# EAGLE board untitled (EAGLE 9.6.2)
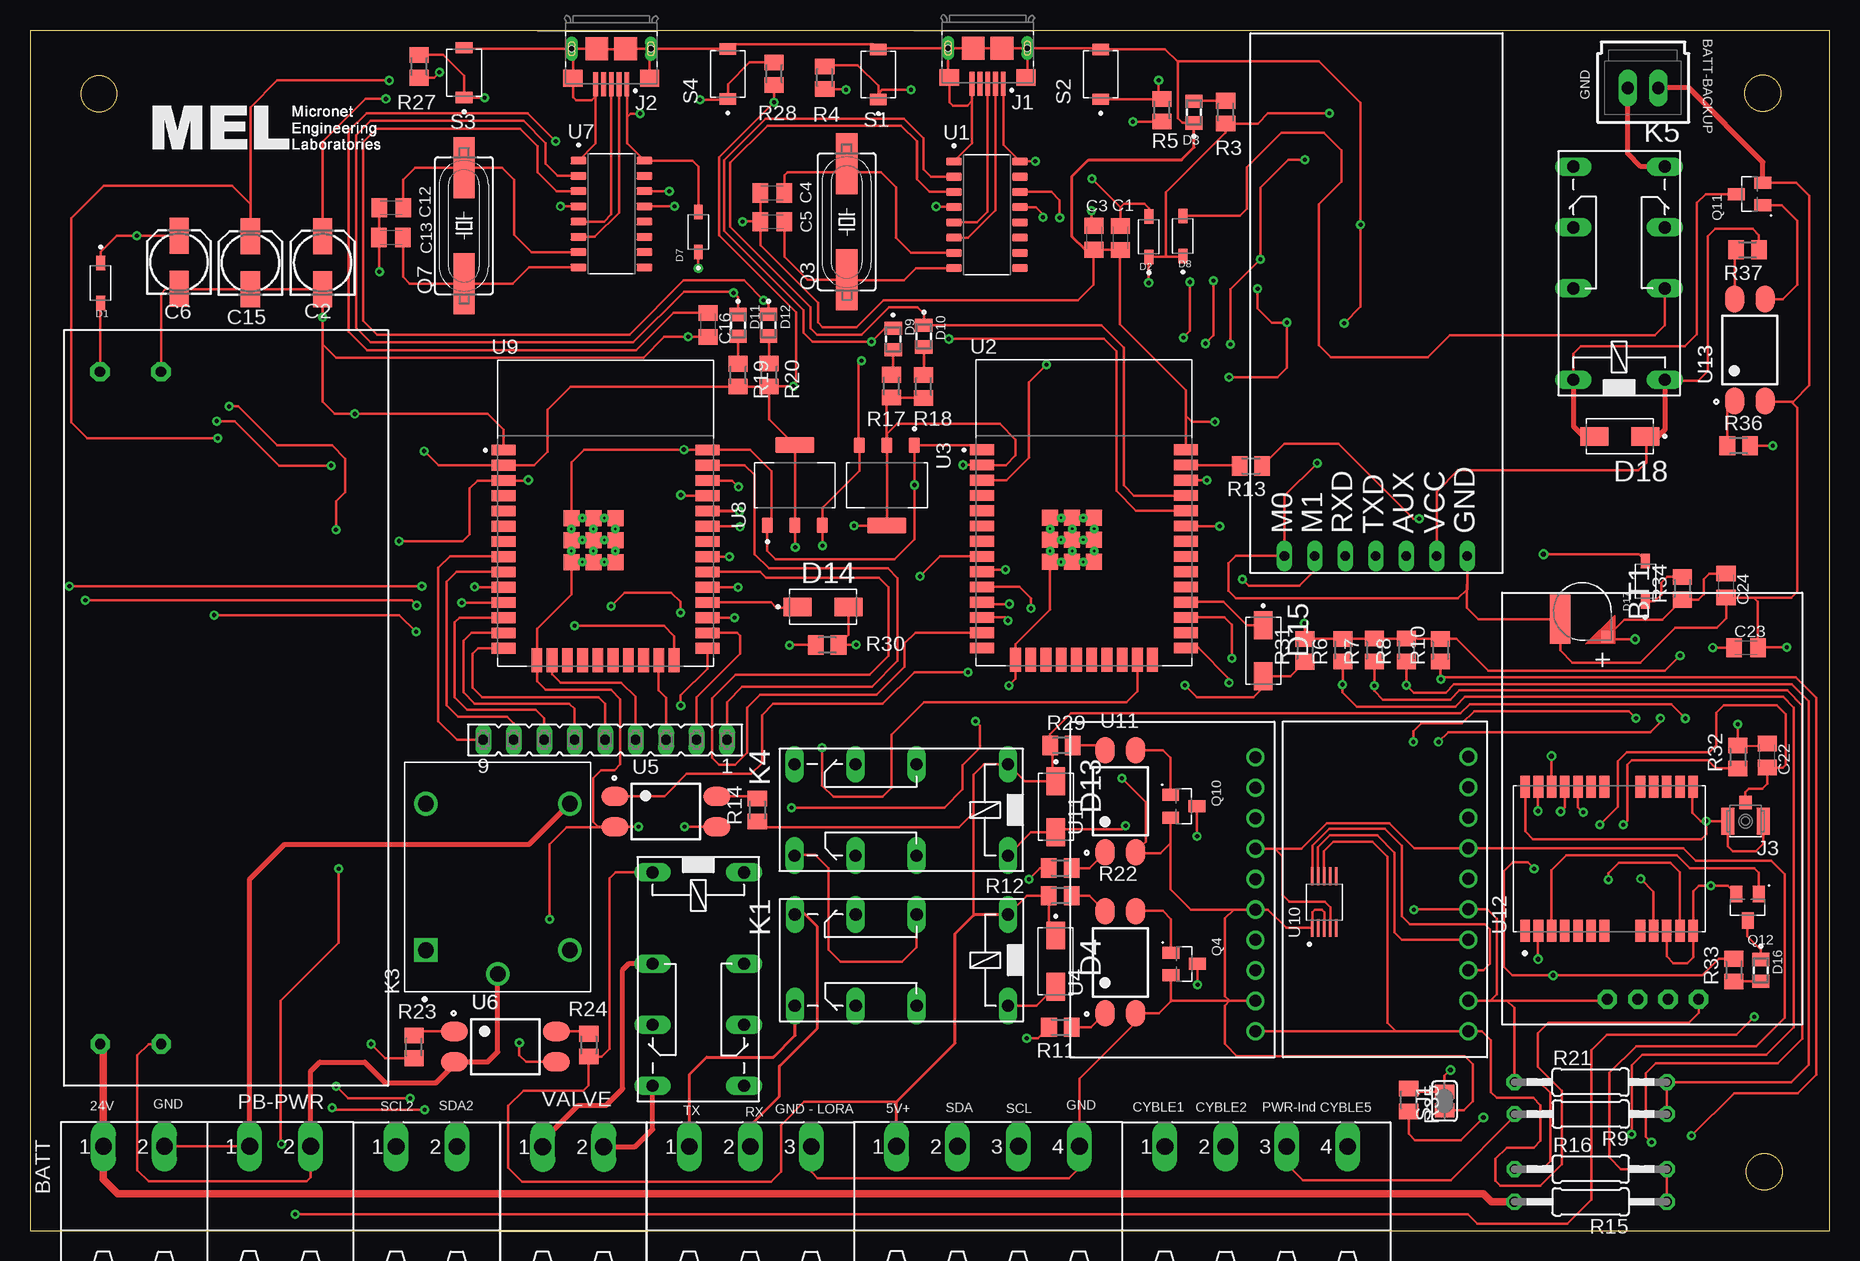
[diagram p1: board, top side]
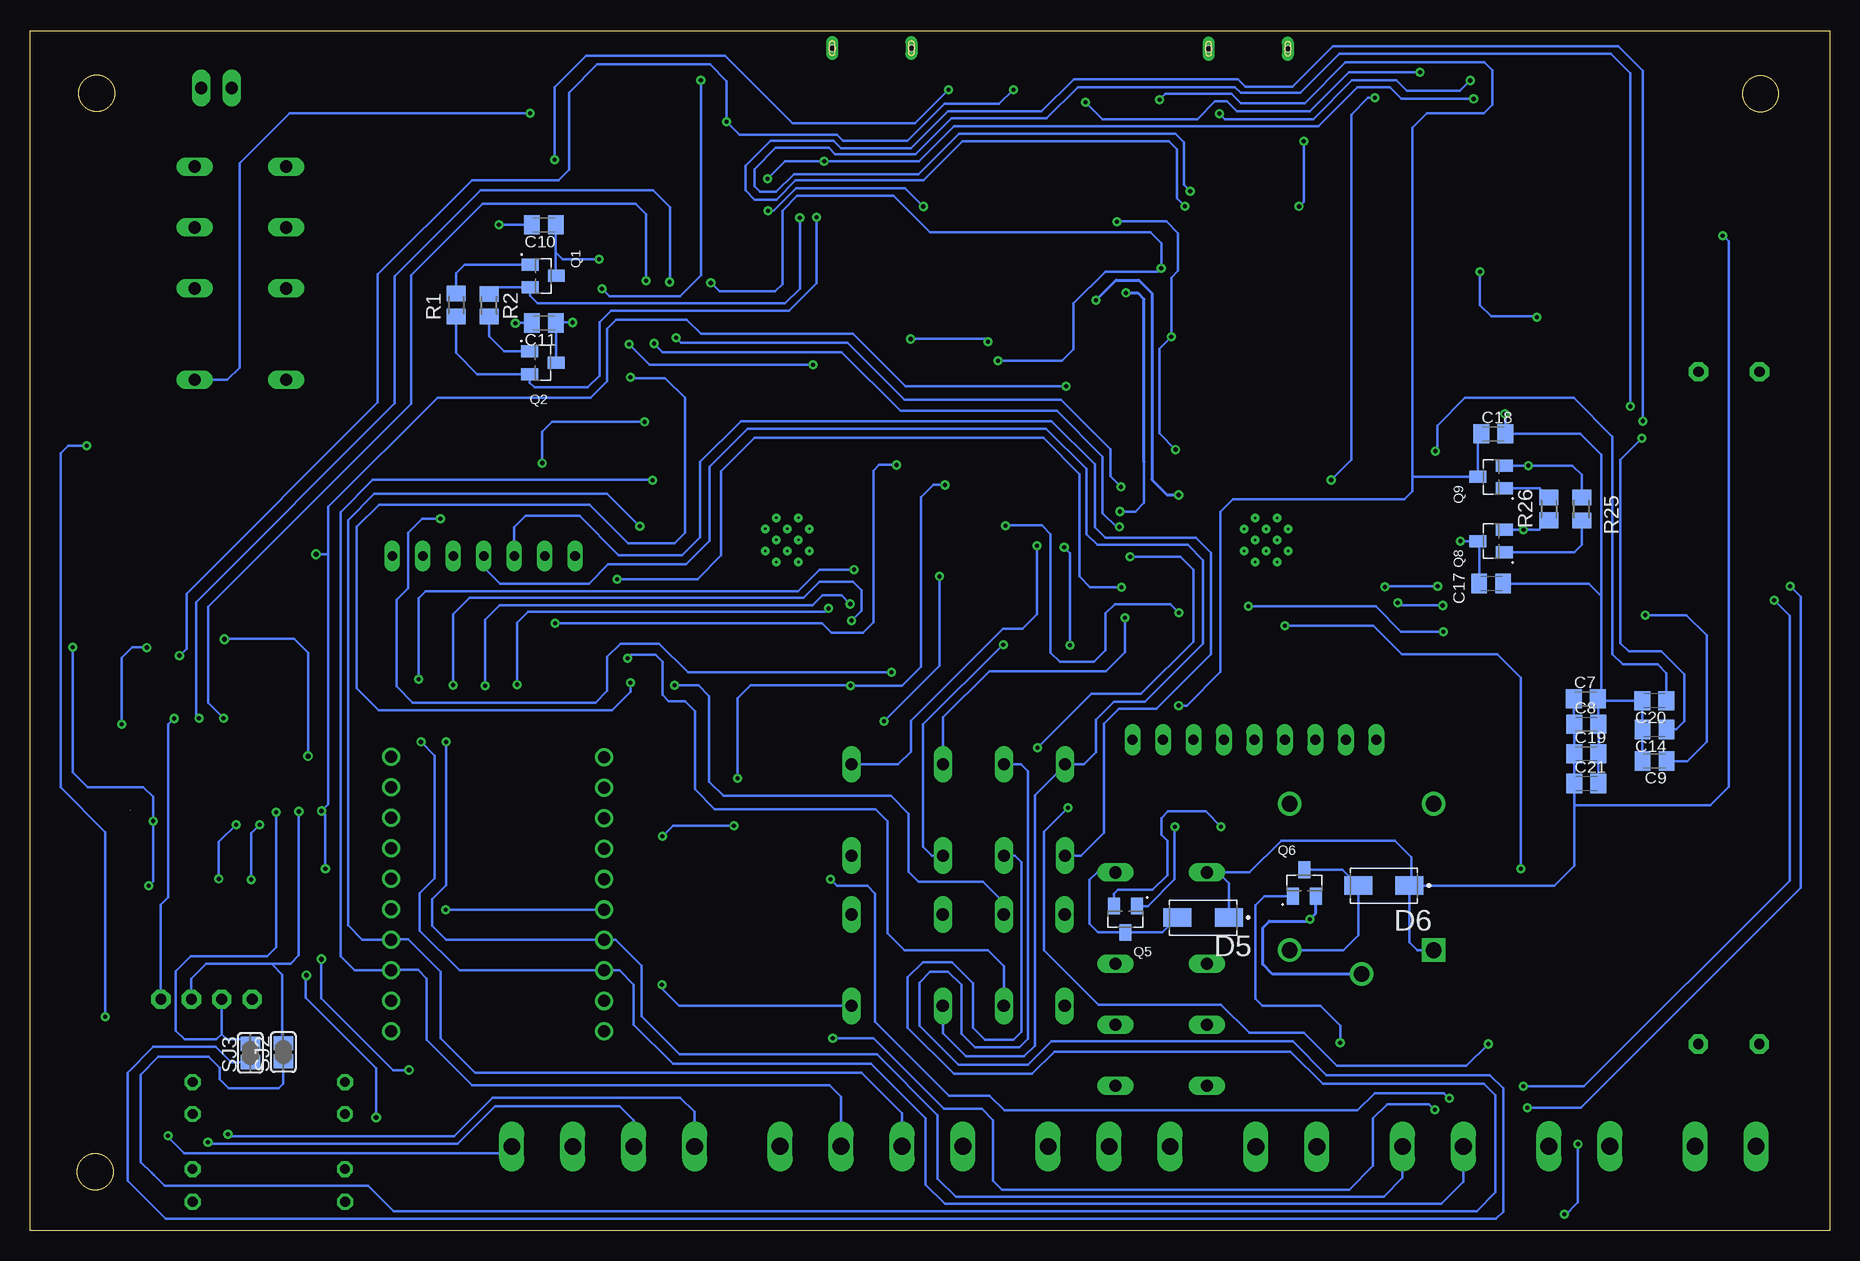
[diagram p2: board, bottom side, seen from below]

Size 150 x 100 mm. Coordinates in mm from the lower left corner, seen from the top.
Outline: 0,0 150,0 150,100 0,100 0,0
Outline: circle at 5.75,94.74 radius 1.5
Outline: circle at 144.45,94.82 radius 1.5
Outline: circle at 144.58,4.94 radius 1.5
Copper layers (1*16): Top 0.035mm / dielectric 1.5mm / Bottom 0.035mm
Design rules "default *": minimum track width 6mil, minimum drill 0.3mm, track to track 6mil, track to pad 6mil, pad to pad 6mil, via to via 6mil, smd to smd 6mil, copper to edge 40mil, drill to drill 6mil, minimum pad ring 10mil, minimum via ring 8mil, stop-mask expansion 4mil, vias tented up to drill 0mil, thermal gap 10mil

## Footprints (pad centres in the part's own frame; a part is rotated, then mirrored left to right if it is on the bottom)
ADS1115 = drill 1: A0 -6.35,-1.27; A1 -6.35,-3.81; A2 -6.35,-6.35; A3 -6.35,-8.89; ADDR -6.35,3.81; ALRT -6.35,1.27; GND -6.35,11.43; SCL -6.35,8.89; SDA -6.35,6.35; VDD -6.35,13.97
SEIKO_ML414H_IV01E = smd 1 x 1: 1 2.1,2.1 | smd 4.1 x 1.7: 2 0.65,-1.85
C0805K = smd 1.3 x 1.6: 1 -1,0; 2 1,0
153CLV-0505 = smd 3 x 1.6: + 2.2,0; - -2.2,0
SOD3715X145N = smd 1.21 x 0.73: A 1.68,0; C -1.68,0
LEDC2012X120N = smd 1.1 x 1.45: A 0.9,0; C -0.9,0
DIOM5226X240N = smd 2.33 x 1.55: A 2.135,0; C -2.135,0
EBYTEE220-900T22D = drill 0.8 pad 1.27 long: AUX -4.56,-10.98; GND -4.56,-16.06; M0 -4.56,-0.82; M1 -4.56,-3.36; RXD -4.56,-5.9; TXD -4.56,-8.44; VCC -4.56,-13.52
FCI_10118193-0001LF = smd 0.4 x 2: 1 -1.3,2.975; 2 -0.65,2.975; 3 0,2.975; 4 0.65,2.975; 5 1.3,2.975 | smd 1.6 x 1.4: S1 -3.2,2.45; S2 3.2,2.45 | smd 1.9 x 1.9: S3 1.2,0; S4 -1.2,0 | drill 0.5 pad 0.9 long: S5 -3.3,0; S6 3.3,0 | hole 0.5: -3.3,0; 3.3,0
HRS_U.FL-R-SMT(01) = smd 1.1 x 2.25: 1 -1.475,0; 2 1.475,0 | smd 1.05 x 1.1: 3 0,-1.55
351 = drill 1.016 long: 1 -3.81,-3.81; 16 -3.81,3.81; O1 8.89,-3.81; O2 8.89,3.81; P1 3.81,-3.81; P2 3.81,3.81; S1 13.97,-3.81; S2 13.97,3.81
RELAY_SRD-05VDC-SL-C = drill 1.32 square: A1 -6.1,6 | drill 1.32: A2 -6.1,-6; NC 6.1,6; NO 6.1,-6 | drill 1.29: COM -8.1,0
NEO-6MGPS = drill 0.9 pad 1.6 octagon: 5V -8.89,7.62; GND -8.89,15.24; RX -8.89,10.16; TX -8.89,12.7
SOT95P240X120-3N = smd 1 x 1.4: 1 -0.95,-1.1; 2 0.95,-1.1; 3 0,1.1
SM49 = smd 5.08 x 1.778: 1 -4.826,0; 2 4.826,0
M0805 = smd 1.3 x 1.6: 1 -0.95,0; 2 0.95,0
0207/12 = drill 0.813 octagon: 1 -6.35,0; 2 6.35,0
SW_TL1015AF160QG = smd 0.95 x 1.4: 1 -2.075,0; 2 2.075,0
SJ = smd 1.168 x 1.6: 1 -0.762,0; 2 0.762,0
SUPER-STEPDOWN = drill 0.85 pad 1.6 octagon: +5V 59.509,24.006; GND 59.509,18.926; IN+ 3.478,23.979; IN- 3.478,18.899
FE09 = drill 0.813 long: 1 -10.16,0; 2 -7.62,0; 3 -5.08,0; 4 -2.54,0; 5 0,0; 6 2.54,0; 7 5.08,0; 8 7.62,0; 9 10.16,0
SOIC127P600X180-16N = smd 1.31 x 0.62: 1 -2.75,4.445; 2 -2.75,3.175; 3 -2.75,1.905; 4 -2.75,0.635; 5 -2.75,-0.635; 6 -2.75,-1.905; 7 -2.75,-3.175; 8 -2.75,-4.445; 9 2.75,-4.445; 10 2.75,-3.175; 11 2.75,-1.905; 12 2.75,-0.635; 13 2.75,0.635; 14 2.75,1.905; 15 2.75,3.175; 16 2.75,4.445
MODULE_ESP32-WROOM-32D = smd 2 x 0.9: 1 -8.5,5.26; 2 -8.5,3.99; 3 -8.5,2.72; 4 -8.5,1.45; 5 -8.5,0.18; 6 -8.5,-1.09; 7 -8.5,-2.36; 8 -8.5,-3.63; 9 -8.5,-4.9; 10 -8.5,-6.17; 11 -8.5,-7.44; 12 -8.5,-8.71; 13 -8.5,-9.98; 14 -8.5,-11.25; 25 8.5,-11.25; 26 8.5,-9.98; 27 8.5,-8.71; 28 8.5,-7.44; 29 8.5,-6.17; 30 8.5,-4.9; 31 8.5,-3.63; 32 8.5,-2.36; 33 8.5,-1.09; 34 8.5,0.18; 35 8.5,1.45; 36 8.5,2.72; 37 8.5,3.99; 38 8.5,5.26 | smd 0.9 x 2: 15 -5.715,-12.25; 16 -4.445,-12.25; 17 -3.175,-12.25; 18 -1.905,-12.25; 19 -0.635,-12.25; 20 0.635,-12.25; 21 1.905,-12.25; 22 3.175,-12.25; 23 4.445,-12.25; 24 5.715,-12.25 | smd 1.33 x 1.33: 39_1 -2.835,-0.405; 39_2 -1,-0.405; 39_3 0.835,-0.405; 39_4 -2.835,-2.24; 39_5 -1,-2.24; 39_6 0.835,-2.24; 39_7 -2.835,-4.075; 39_8 -1,-4.075; 39_9 0.835,-4.075 | drill 0.2 pad 0.3: 39_10 -1.917,-0.405; 39_11 -0.083,-0.405; 39_12 -2.835,-1.323; 39_13 -1,-1.323; 39_14 0.835,-1.323; 39_15 -1.917,-2.24; 39_16 -0.083,-2.24; 39_17 -2.835,-3.158; 39_18 -1,-3.158; 39_19 0.835,-3.158; 39_20 -1.917,-4.075; 39_21 -0.083,-4.075
SOT229P700X180-4N = smd 1.31 x 0.93: 1 -3.345,2.29; 2 -3.345,0; 3 -3.345,-2.29 | smd 1.31 x 3.24: 4 3.345,0
SOT254P975X400-4N = smd 2.25 x 1.6: 1 -4.25,1.27; 2 -4.25,-1.27; 3 4.25,-1.27; 4 4.25,1.27
SOP50P490X110-10N = smd 1.47 x 0.28: 1 -2.15,1; 2 -2.15,0.5; 3 -2.15,0; 4 -2.15,-0.5; 5 -2.15,-1; 6 2.15,-1; 7 2.15,-0.5; 8 2.15,0; 9 2.15,0.5; 10 2.15,1
XCVR_NEO-M8N-0 = smd 1.8 x 0.8: 1 -6,7; 2 -6,5.9; 3 -6,4.8; 4 -6,3.7; 5 -6,2.6; 6 -6,1.5; 7 -6,0.4; 8 -6,-2.6; 9 -6,-3.7; 10 -6,-4.8; 11 -6,-5.9; 12 -6,-7; 13 6,-7; 14 6,-5.9; 15 6,-4.8; 16 6,-3.7; 17 6,-2.6; 18 6,0.4; 19 6,1.5; 20 6,2.6; 21 6,3.7; 22 6,4.8; 23 6,5.9; 24 6,7
MSTBA2 = drill 1.397 long: 1 -2.54,5.08; 2 2.54,5.08
MSTBA4 = drill 1.397 long: 1 -7.62,5.08; 2 -2.54,5.08; 3 2.54,5.08; 4 7.62,5.08
MSTBA3 = drill 1.397 long: 1 -5.08,5.08; 2 0,5.08; 3 5.08,5.08
70543-02 = drill 1.016 long: 1 -1.27,0; 2 1.27,0

## Placement (x,y rotation side)
ADS1  [ADS1115]  113.53,30.61 180 top
ADS2  [ADS1115]  95.8,30.59 180 top
BT1  ML414H_IV01E  [SEIKO_ML414H_IV01E]  129.4,51.62 270 top
C1  1uF  [C0805K]  90.89,82.75 270 top
C2  10uF/16V  [153CLV-0505]  24.39,80.68 90 top
C3  100nF  [C0805K]  88.7,82.76 270 top
C4  22pF  [C0805K]  61.88,86.48 0 top
C5  22pF  [C0805K]  61.89,84.09 0 top
C6  10uF/16V  [153CLV-0505]  12.43,80.73 90 top
C7  1uF  [C0805K]  20.31,44.33 0 bottom
C8  1uF  [C0805K]  20.27,42.21 0 bottom
C9  1uF  [C0805K]  14.59,39.15 180 bottom
C10  100nF  [C0805K]  107.17,83.84 180 bottom
C11  100nF  [C0805K]  107.16,75.66 180 bottom
C12  22pF  [C0805K]  30.12,85.26 0 top
C13  22pF  [C0805K]  30.1,82.78 0 top
C14  1uF  [C0805K]  14.6,41.79 180 bottom
C15  10uF/16V  [153CLV-0505]  18.38,80.67 90 top
C16  100nF  [C0805K]  56.52,75.5 270 top
C17  100nF  [C0805K]  28.19,53.95 0 bottom
C18  100nF  [C0805K]  28.02,66.42 0 bottom
C19  1uF  [C0805K]  20.27,39.76 0 bottom
C20  1uF  [C0805K]  14.6,44.19 180 bottom
C21  100nF  [C0805K]  20.27,37.28 0 bottom
C22  27nH  [C0805K]  144.81,39.6 270 top
C23  10nF  [C0805K]  143.04,48.59 0 top
C24  1uF  [C0805K]  141.38,53.77 270 top
D1  1N5819HW-7  [SOD3715X145N]  5.89,78.98 270 top
D2  1N5819HW-7  [SOD3715X145N]  93.26,82.85 90 top
D3  SML-LXT0805IW-TR  [LEDC2012X120N]  97.02,93.23 90 top
D4  US1M-13  [DIOM5226X240N]  85.5,22.48 270 top
D5  US1M-13  [DIOM5226X240N]  52.21,26.11 180 bottom
D6  US1M-13  [DIOM5226X240N]  37.15,28.78 180 bottom
D7  1N5819HW-7  [SOD3715X145N]  55.71,83.24 90 top
D8  1N5819HW-7  [SOD3715X145N]  96.1,82.9 90 top
D9  SML-LXT0805IW-TR  [LEDC2012X120N]  71.94,74.32 270 top
D10  SML-LXT0805IW-TR  [LEDC2012X120N]  74.51,74.56 270 top
D11  SML-LXT0805IW-TR  [LEDC2012X120N]  59.02,75.46 270 top
D12  SML-LXT0805IW-TR  [LEDC2012X120N]  61.57,75.48 270 top
D13  US1M-13  [DIOM5226X240N]  85.51,35.33 270 top
D14  US1M-13  [DIOM5226X240N]  66.1,52 0 top
D15  US1M-13  [DIOM5226X240N]  102.79,48.34 270 top
D16  SML-LXT0805IW-TR  [LEDC2012X120N]  144.27,21.71 270 top
D17  1N5819HW-7  [SOD3715X145N]  134.65,54.13 90 top
D18  US1M-13  [DIOM5226X240N]  132.52,66.21 180 top
EBYTEE220-900T22D1  [EBYTEE220-900T22D]  103.74,60.81 90 top
J1  10118193-0001LF  [FCI_10118193-0001LF]  79.83,98.56 180 top
J2  10118193-0001LF  [FCI_10118193-0001LF]  48.45,98.51 180 top
J3  U.FL-R-SMT(01)  [HRS_U.FL-R-SMT(01)]  143,34.15 180 top
K1  351  [351]  77.72,22.56 180 top
K2  351  [351]  55.71,26.06 270 top
K3  SRD-05VDC-SL-C  [RELAY_SRD-05VDC-SL-C]  39,29.5 90 top
K4  351  [351]  77.7,35.08 180 top
K5  351  [351]  132.46,74.73 90 top
NEO-6MGPS1  [NEO-6MGPS]  146.71,28.19 90 top
Q1  MMBT3904  [SOT95P240X120-3N]  107.22,79.58 270 bottom
Q2  MMBT3904  [SOT95P240X120-3N]  107.24,72.36 270 bottom
Q3  12MHz  [SM49]  68.09,84.08 90 top
Q4  S9013  [SOT95P240X120-3N]  96.2,22.24 270 top
Q5  S9013  [SOT95P240X120-3N]  58.68,25.97 180 bottom
Q6  S9013  [SOT95P240X120-3N]  43.78,28.99 0 bottom
Q7  12MHz  [SM49]  36.18,83.76 90 top
Q8  MMBT3904  [SOT95P240X120-3N]  28.21,57.48 90 bottom
Q9  MMBT3904  [SOT95P240X120-3N]  28.2,62.83 90 bottom
Q10  S9013  [SOT95P240X120-3N]  96.18,35.38 270 top
Q11  S9013  [SOT95P240X120-3N]  143.34,86.4 90 top
Q12  S9013  [SOT95P240X120-3N]  143.17,26.97 180 top
R1  10k  [M0805]  114.48,77.15 90 bottom
R2  10k  [M0805]  111.73,77.13 270 bottom
R3  1k  [M0805]  99.66,93.22 270 top
R4  10k  [M0805]  66.24,96.1 270 top
R5  10k  [M0805]  94.35,93.39 270 top
R6  560  [M0805]  109.43,48.39 90 top
R7  560  [M0805]  112.06,48.4 90 top
R8  560  [M0805]  114.72,48.4 90 top
R9  [0207/12]  130.1,9.73 180 top
R10  560  [M0805]  117.56,48.39 90 top
R11  1k  [M0805]  85.89,16.96 180 top
R12  10k  [M0805]  85.88,27.93 0 top
R13  1k  [M0805]  101.77,63.75 180 top
R14  10k  [M0805]  60.62,35.07 90 top
R15  [0207/12]  130.09,2.42 180 top
R16  [0207/12]  130.1,5.15 0 top
R17  10k  [M0805]  71.82,70.39 270 top
R18  10k  [M0805]  74.49,70.37 270 top
R19  10k  [M0805]  59.01,71.31 270 top
R20  10k  [M0805]  61.6,71.32 270 top
R21  [0207/12]  130.09,12.4 0 top
R22  1k  [M0805]  85.87,30.24 180 top
R23  1k  [M0805]  32.01,15.33 270 top
R24  10k  [M0805]  46.58,15.48 90 top
R25  10k  [M0805]  20.66,60.15 270 bottom
R26  10k  [M0805]  23.41,60.17 90 bottom
R27  10k  [M0805]  32.44,97.04 270 top
R28  10k  [M0805]  62.03,96.42 270 top
R29  10k  [M0805]  85.98,40.45 0 top
R30  560  [M0805]  66.45,48.82 0 top
R31  10k  [M0805]  106.27,48.37 90 top
R32  10  [M0805]  142.35,39.48 90 top
R33  1k  [M0805]  142.03,21.73 90 top
R34  1k  [M0805]  137.72,53.54 90 top
R35  10k  [M0805]  114.92,10.91 270 top
R36  1k  [M0805]  142.43,65.43 0 top
R37  10k  [M0805]  143.17,81.76 180 top
S1  TL1015AF160QG  [SW_TL1015AF160QG]  70.71,96.37 90 top
S2  TL1015AF160QG  [SW_TL1015AF160QG]  89.26,96.37 90 top
S3  TL1015AF160QG  [SW_TL1015AF160QG]  36.19,96.52 90 top
S4  TL1015AF160QG  [SW_TL1015AF160QG]  58.17,96.41 90 top
SJ1  [SJ]  117.91,10.81 90 top
SJ2  [SJ]  128.88,14.89 90 bottom
SJ3  [SJ]  131.63,14.83 90 bottom
SUPER-STEPDOWN1  [SUPER-STEPDOWN]  29.84,12.09 90 top
SV1  [FE09]  47.94,40.92 180 top
U1  CH340G  [SOIC127P600X180-16N]  79.77,84.67 0 top
U2  ESP32-WROOM-32D  [MODULE_ESP32-WROOM-32D]  87.86,59.83 0 top
U3  AMS1117  [SOT229P700X180-4N]  71.43,62.14 270 top
U4  PC817X2NIP0F  [SOT254P975X400-4N]  90.89,22.38 90 top
U5  PC817X2NIP0F  [SOT254P975X400-4N]  53,34.94 0 top
U6  PC817X2NIP0F  [SOT254P975X400-4N]  39.61,15.34 0 top
U7  CH340G  [SOIC127P600X180-16N]  48.47,84.74 0 top
U8  AMS1117  [SOT229P700X180-4N]  63.76,62.13 90 top
U9  ESP32-WROOM-32D  [MODULE_ESP32-WROOM-32D]  47.97,59.81 0 top
U10  ADS1115IDGSR  [SOP50P490X110-10N]  107.89,27.39 90 top
U11  PC817X2NIP0F  [SOT254P975X400-4N]  90.89,35.8 90 top
U12  NEO-M8N-0  [XCVR_NEO-M8N-0]  131.63,31.01 90 top
U13  PC817X2NIP0F  [SOT254P975X400-4N]  143.36,73.39 90 top
X1  MSTBA2  [MSTBA2]  8.66,1.96 0 top
X2  MSTBA2  [MSTBA2]  20.85,1.97 0 top
X3  MSTBA4  [MSTBA4]  102.21,1.96 0 top
X4  MSTBA3  [MSTBA3]  60.05,1.95 0 top
X5  MSTBA2  [MSTBA2]  45.28,1.93 0 top
X6  MSTBA4  [MSTBA4]  79.85,1.96 0 top
X7  C-GRID-02-70543  [70543-02]  134.46,95.24 180 top
X8  MSTBA2  [MSTBA2]  33.05,1.95 0 top

## Tracks (layer width: path | path; a pad name or v marks a point on that pad's centre or on a via)
24V+
  Top 0.61: SUPER-STEPDOWN1.IN+ 6.12,15.31 X1.1 6.12,4.29 7.31,3.1 121.13,3.1 121.81,2.42 R15.2
A0
  Top 0.203: R15.1 136.44,5.13 R16.2 132.61,5.15 131.64,6.12 131.64,13.16 133.89,15.4 143.92,15.4 146.27,17.75 146.27,29.71 145.14,30.84 138.86,30.84 137.82,31.88 ADS1.A0 115.41,31.88 113.31,33.97 108.11,33.97 105.99,31.86 103.78,31.86 | U10.4 108.39,26.96 107.92,27.43 104.97,27.43 104.4,28 104.4,31.24 103.78,31.86 | 103.78,31.86 ADS2.A0
BACKUP  (via drill 0.4)
  Top 0.203: BT1.1 131.53,49.56 | 131.53,49.56 132.91,50.93 136.06,50.93 R34.1 139.06,52.59 139.51,53.05 139.51,54.3 139.98,54.77 C24.1 | U12.22 v126.83,39.56 v126.82,39.56 | v133.8,49.29 131.8,49.29 131.53,49.56
  Bottom 0.203: v126.82,39.56 126.82,48.19 127.97,49.33 133.76,49.33 v133.8,49.29
CONFIG_LORA  (via drill 0.35)
  Top 0.203: R11.2 84.03,16.05 v83.09,16.05 | v32.9,10.09 25.32,10.09 25.17,10.24 v25.18,10.25 | v3.29,53.72 32.65,53.72 v32.67,53.71 | v37.06,53.66 37.08,53.64 U9.10
  Bottom 0.203: v83.09,16.05 79.68,16.05 73.8,10.17 70.67,10.17 69.71,9.21 69.71,4.17 68.99,3.45 40.03,3.45 38.05,5.43 38.05,9.38 36.86,10.57 33.38,10.57 v32.9,10.09 | v25.18,10.25 20.75,10.25 2.4,28.61 2.4,52.83 v3.29,53.72 | v32.67,53.71 37.01,53.71 v37.06,53.66
CYBLE1  (via drill 0.35)
  Top 0.203: v133.5,8.06 133.5,13.8 134.38,14.68 144.75,14.68 147.03,16.96 147.03,43.6 146.14,44.49 119.62,44.49 118.82,43.69 110.61,43.69 109.41,44.89 v109.41,45.52 109.43,45.54 R6.1 | U2.10 82.49,53.66 83.44,52.71 v83.44,51.87
  Bottom 0.203: X3.1 94.59,9.91 95.79,11.11 111.43,11.11 114.66,7.88 133.32,7.88 v133.5,8.06 | v109.41,45.52 109.41,50.66 108.49,51.58 83.74,51.58 v83.44,51.87
CYBLE2  (via drill 0.35)
  Top 0.203: v135.17,7.38 134.69,7.86 134.69,13.12 135.53,13.96 145.71,13.96 147.74,15.99 147.74,43.78 146.47,45.05 119.15,45.05 118.39,44.28 112.79,44.28 112.06,45.01 v112.06,45.43 R7.1 | v81.63,52.24 79.51,52.24 U2.11
  Bottom 0.203: X3.2 99.67,9.21 100.84,10.38 111.24,10.38 114.35,7.27 135.05,7.27 v135.17,7.38 | v112.06,45.43 112.06,50.91 110.84,52.13 84.77,52.13 83.93,52.98 82.37,52.98 v81.63,52.24
CYBLE3  (via drill 0.35)
  Top 0.203: R9.1 R21.2 146.82,12.4 148.29,13.86 148.29,44.11 146.86,45.54 118.71,45.54 118.02,44.86 115.34,44.86 v114.72,45.48 R8.1 | v81.52,50.86 81.26,51.12 U2.12
  Bottom 0.203: v114.72,45.48 114.72,51.36 113.33,52.75 85.54,52.75 84.19,54.1 81.41,54.1 80.7,53.39 80.7,51.68 v81.52,50.86 | v81.52,50.86
CYBLE4  (via drill 0.35)
  Top 0.203: R23.2 29.61,14.38 v28.43,15.57 | v63.48,35.27 76.21,35.27 77.73,36.79 77.73,38.8 79.2,40.26 79.2,42.09 v78.82,42.46 | v74.18,54.53 75.85,56.2 U2.8
  Bottom 0.203: v28.43,15.57 30.25,13.75 41.05,13.75 43.8,16.49 48.34,16.49 50.71,18.86 60.94,18.86 65.48,23.4 65.48,33.27 v63.48,35.27 | v78.82,42.46 74.18,47.11 v74.18,54.53
CYBLE5  (via drill 0.35)
  Top 0.203: R10.1 117.56,46 v117.6,45.96 117.75,46.12 147.2,46.12 148.88,44.44 148.88,13.01 147.35,11.49 142.05,11.49 v138.5,7.94 | v81.3,55.11 79.54,55.11 U2.9
  Bottom 0.203: X3.4 110.4,6.47 137.16,6.47 138.5,7.81 v138.5,7.94 | v117.6,45.96 117.6,52.73 117.03,53.3 85.98,53.3 84.17,55.11 v81.3,55.11
D_SEL  (via drill 0.4)
  Top 0.203: R35.1 115.2,11.58 SJ1.2 117.91,12.91 v118.4,13.4 | v125.7,22.64 125.7,24.98 U12.2
  Bottom 0.203: v118.4,13.4 119.74,13.4 125.72,19.39 125.72,22.64 v125.7,22.64
DTR  (via drill 0.35)
  Top 0.203: v84.44,84.48 84.44,84.72 83.86,85.31 U1.13
  Bottom 0.203: R1.1 114.48,73.16 112.72,71.41 Q2.2 108.35,70.68 107.95,70.29 103.51,70.29 102.54,71.26 102.54,75.73 101.58,76.69 86.73,76.69 84.44,78.97 v84.44,84.48
DTR1  (via drill 0.35)
  Top 0.203: v25.1,63.78 20.76,63.78 17.05,67.48 v15.57,67.48 | v53.72,85.37 U7.13 | U7.13
  Bottom 0.203: R25.1 20.66,62.99 21.45,63.78 v25.1,63.78 Q9.2 | v15.57,67.48 15.57,96.69 17.6,98.72 41.4,98.72 44.76,95.36 48.69,95.36 49.31,95.97 63,95.97 65.67,93.3 73.48,93.3 76.54,90.24 82.41,90.24 83.02,90.84 88.29,90.84 90.36,88.77 90.36,86.71 89.59,85.95 87.78,85.95 86.17,87.55 75.53,87.55 72.29,90.79 55.07,90.79 54.41,90.13 54.41,86.06 v53.72,85.37
EN  (via drill 0.35)
  Top 0.203: S1.1 70.71,94.78 | 70.71,94.78 70.71,95.42 68.99,97.15 66.35,97.15 R4.1 | v73.45,95.09 71.02,95.09 70.71,94.78 | U2.3 81.4,62.55 83.29,64.43 83.29,70.72 v84.74,72.17 | v100.06,73.88 100.06,78.46 v102.56,80.96 102.56,86.95 104.88,89.26 v106.27,89.26
  Bottom 0.203: Q1.3 106.17,79.63 106.17,81.53 | 106.17,81.53 C10.1 | v73.45,95.09 76.23,92.31 86.45,92.31 92.08,97.94 103.64,97.94 106.27,95.31 v106.27,89.26 | v84.74,72.17 98.35,72.17 v100.06,73.88 | v102.56,80.96 105.6,80.96 106.17,81.53
EN1  (via drill 0.35)
  Top 0.203: R27.1 32.84,98 32.84,97.99 34.46,97.99 36.19,96.26 S3.1 37.76,94.45 37.78,94.42 v37.9,94.42 | v30.77,57.48 36.07,57.48 36.64,58.05 36.64,61.87 37.3,62.53 U9.3 41.5,62.53 v41.54,62.57
  Bottom 0.203: C17.1 29.19,57.37 Q8.3 v30.77,57.48 | v41.54,62.57 39.86,64.26 39.86,93.03 38.46,94.42 v37.9,94.42
GND  (via drill 0.35)
  Top 0.2: v140.1,28.76 141.53,28.76 Q12.2
  Top 0.203: J2.S6 J2.S3 47.31,98.45 49.59,98.45 J2.S4 J2.S5 | J2.S5 51.65,98.41 J2.S1 | J2.S6 45.25,98.41 J2.S2 45.25,94.47 45.51,94.21 46.8,94.21 47.15,94.56 | 47.15,94.56 J2.5 | J2.S6 36.28,98.51 S3.2 | J2.S5 58.14,98.51 S4.2 58.58,98.88 70.27,98.88 S1.2 70.83,98.56 J1.S6 | J1.S6 76.53,96.21 J1.S2 76.63,94.06 76.93,93.76 78.13,93.76 78.53,94.16 | 78.53,94.16 J1.5 | J1.S6 J1.S3 J1.S4 J1.S5 | J1.S5 83.13,96.21 J1.S1 | J1.S5 89.15,98.56 S2.2 89.29,98.48 94.62,98.48 95.63,97.47 | C12.1 29.12,82.8 C13.1 29.1,79.95 v29.13,79.92 | 12.46,78.5 C6.- | SUPER-STEPDOWN1.GND 10.92,78.09 11.33,78.5 12.46,78.5 | 12.46,78.5 12.49,78.47 C15.- 18.39,78.48 C2.- v24.39,76.14 24.39,73.9 | U7.1 47.15,90.62 47.15,94.56 | U1.1 78.53,90.62 78.53,94.16 | 60.88,84.15 C5.1 60.89,82.13 65.67,77.35 65.67,75.71 66.08,75.3 68.91,75.3 71.14,77.54 87.34,77.54 88.65,78.85 88.65,81.6 88.49,81.76 | 60.88,84.15 C4.1 | 88.66,81.72 C3.2 C1.2 90.87,81.73 90.87,75.56 96.36,70.07 96.36,67.93 | U9.39_1 U9.39_10 46.94,59.4 | 46.94,59.4 U9.39_2 U9.39_11 48.77,59.4 | 48.77,59.4 U9.39_3 | 48.77,59.4 48.77,58.51 U9.39_14 48.8,57.58 | 48.8,57.58 U9.39_6 U9.39_19 U9.39_9 U9.39_21 U9.39_8 | 46.94,59.4 46.94,58.51 U9.39_13 U9.39_5 | U9.39_1 U9.39_12 U9.39_4 45.18,57.57 | 45.18,57.57 U9.39_15 46.9,57.57 | 46.9,57.57 U9.39_5 | U9.39_5 U9.39_16 47.9,57.58 48.8,57.58 | 46.9,57.57 46.9,56.72 U9.39_18 U9.39_8 | 45.18,57.57 45.13,57.52 U9.39_17 U9.39_7 | U9.39_8 U9.39_20 U9.39_7 | 86.77,59.42 U2.39_10 U2.39_1 U2.39_12 U2.39_4 | 86.77,59.42 U2.39_2 U2.39_11 88.68,59.42 | U2.39_3 88.68,59.42 | 88.68,59.42 88.68,58.52 U2.39_14 U2.39_6 88.63,57.59 | 86.77,59.42 86.77,58.6 U2.39_13 U2.39_5
  Top 0.203: U2.39_4 U2.39_15 86.77,57.59 | 86.77,57.59 U2.39_5 | U2.39_5 U2.39_16 88.63,57.59 | 88.63,57.59 88.63,56.74 U2.39_19 88.69,55.77 | 88.69,55.77 U2.39_9 | 86.77,57.59 86.77,56.77 U2.39_18 86.86,55.84 | 86.86,55.84 U2.39_8 | 86.94,55.75 U2.39_21 87.79,55.77 88.69,55.77 | 86.94,55.75 86.86,55.84 | 86.94,55.75 U2.39_20 U2.39_7 85.03,51.78 82.14,48.9 U2.15 82.14,45.99 v81.59,45.44 | U2.39_17 U2.39_4 | U2.1 78.97,65.48 U3.1 v73.72,62.16 73.72,57.64 72.05,55.96 62.13,55.96 61.44,56.66 61.44,58.75 U8.1 61.82,59.13 61.82,63.28 60.01,65.09 56.49,65.09 U9.38 56.42,65.11 v54.51,65.11 46.2,65.11 45.13,64.04 U9.39_1 | X2.2 23.39,4.47 23.04,4.13 9.89,4.13 8.95,5.07 8.95,14.63 9.88,15.57 SUPER-STEPDOWN1.IN- | R16.1 126.08,5.15 126.72,5.79 126.72,11.5 125.79,12.43 123.77,12.43 R21.1 123.74,18.57 123.12,19.19 | 95.1,19.3 95.1,19.15 94.08,18.13 U4.2 92.16,17.35 87.47,12.66 87.47,7.06 | 95.1,19.3 Q4.2 | 99.98,19.16 ADS2.GND 100.01,19.16 99.61,19.56 99.61,26.04 100.35,26.78 | 99.98,19.16 95.24,19.16 95.1,19.3 | Q10.2 95.08,32.29 | 95.08,32.29 94.25,31.46 92.25,31.46 U11.2 93.02,32.41 93.02,35.72 v91.02,37.71 | D3.C 96.05,92.33 95.67,92.71 95.67,97.43 95.63,97.47 | 24.39,73.9 24.39,69.09 25.4,68.08 v27.08,68.08 38.17,68.08 39.47,66.78 U9.1 | v43.31,25.97 43.31,32.23 44.72,33.64 47.93,33.64 48.18,33.4 48.48,33.4 U5.2 | 29.72,12.34 29.61,12.34 27.82,14.13 24.22,14.13 24.15,14.06 | 35.37,13.86 U6.2 | U5.2 47.35,33.67 46.92,34.1 46.92,37.7 47.62,38.4 48.73,38.4 49.19,38.86 49.19,44.31 48.43,45.07 42.96,45.07 42.25,45.78 U9.15 42.25,50.18 45.13,53.06 U9.39_7 | ADS1.GND 121.68,19.18
  Top 0.203: 121.68,19.18 121.73,19.18 122.27,19.73 122.27,26.01 121.48,26.8 ADS1.ADDR 115.37,26.8 v115.34,26.77 | 123.12,19.19 121.7,19.19 121.68,19.18 | 123.12,19.19 131.37,19.19 NEO-6MGPS1.GND | U10.3 107.9,25.26 107.9,26.54 107.67,26.77 107.11,26.77 106.89,26.55 U10.1 104.73,25.24 103.19,26.78 ADS2.ADDR 100.35,26.78 | C16.2 v54.87,74.5 52.85,74.5 51.13,72.78 25.52,72.78 24.39,73.9 | 96.65,65.38 U2.38 96.36,67.93 | 95.63,97.47 107.44,97.47 110.91,94 v110.91,83.84 | v59.41,84.09 59.46,84.15 60.88,84.15 | v109.54,75.63 110.91,77 v110.91,83.84 | v110.91,83.84 110.91,83.85 | 87.47,7.06 X6.4 87.47,5.27 86.59,4.38 65.66,4.38 65.13,4.92 X4.3 | 87.51,7.02 87.47,7.06 | v50.72,33.68 50.71,33.67 U5.2 | 104.52,56.21 EBYTEE220-900T22D1.M0 | 100.35,26.78 96.76,26.78 95.08,28.47 95.08,32.29 | EBYTEE220-900T22D1.M0 100.5,56.25 99.9,55.64 99.9,53.33 100.51,52.72 119.03,52.72 119.8,53.49 119.8,53.87 | 119.8,53.87 EBYTEE220-900T22D1.GND | 139.7,34.15 v139.74,34.15 J3.2 141.52,32.04 141.93,31.64 143.86,31.64 144.48,32.26 144.48,34.14 J3.1 | 139.7,34.15 139.26,34.15 138.58,34.84 138.58,36.96 U12.13 | v140.1,28.76 139.09,28.76 138.63,28.29 U12.12 138.63,22.79 138.14,22.3 137,22.3 136.43,22.87 U12.10 | U12.24 124.63,33.3 125.28,32.65 139.3,32.65 139.72,33.06 139.72,34.13 139.7,34.15 | SJ1.1 119.53,10.05 120.27,10.79 120.27,13.88 119.59,14.57 100.61,14.57 99.6,15.58 99.6,18.78 99.98,19.16 | 144.1,48.66 C23.2 | Q11.2 147.25,87.35 148.33,86.27 148.33,70.48 146.96,69.11 146.81,69.11 | 146.81,69.11 144.67,69.11 U13.2 | 119.8,53.87 119.78,53.84 119.78,51.94 120.75,50.97 BT1.2 127.55,48.38 128.58,47.35 134.22,47.35 137.13,50.27 140.6,50.27 141.38,51.05 C24.2 143.7,52.77
  Top 0.203: 143.7,52.77 146.82,52.77 147.3,53.26 147.3,68.61 146.81,69.11 | C23.2 144.07,48.63 v146.43,48.63 | C23.2 144.04,52.44 143.7,52.77 | EBYTEE220-900T22D1.M0 104.56,61.24 v107.3,63.98 | v98.78,67.41 96.87,67.41 96.36,67.93
  Top 0.254: C3.2 88.49,81.76 87.96,81.76 86.87,82.85 86.87,87.9 88.23,89.26 96,89.26 97.03,90.29 D3.C
  Top 0.406: U6.2 38.16,14.07 39,14.91 K3.COM | X2.2 23.39,13.3 24.15,14.06 27.9,14.06 29.61,12.34 | 29.72,12.34 33.85,12.34 35.37,13.86 | Q11.2 144.44,89.06 138.25,95.25 X7.1
  Bottom 0.203: C14.2 15.6,41.94 | 15.6,41.94 C20.2 19.16,44.19 C7.2 | C7.2 19.27,44.29 C8.2 19.23,42.17 19.23,39.8 C19.2 C21.2 | C9.2 15.59,41.93 15.6,41.94 | C10.2 v110.91,83.84 | v27.08,68.08 27.02,68.02 C18.2 20.75,66.42 19.03,64.69 19.03,52.89 | C7.2 19.02,44.62 19.02,52.44 19.03,52.45 19.03,52.89 | C17.2 20.08,53.95 19.03,52.89 | v29.13,79.92 29.13,77.15 28.18,76.2 24.42,76.2 24.39,76.17 v24.39,76.14 | v54.51,65.11 55.87,66.47 55.87,73.49 v54.87,74.5 54.87,79.44 54.29,80.02 54.29,83.13 55.28,84.12 59.38,84.12 v59.41,84.09 | C11.2 109.52,75.66 v109.54,75.63 | v115.34,26.77 115.33,26.78 ADS2.ADDR | Q5.2 59.63,28.08 59.3,28.42 56.42,28.42 55.19,29.65 55.19,32.52 55.69,33.02 55.69,34.39 55.13,34.96 52,34.96 v50.72,33.68 | v91.02,37.71 91.02,44.39 89.95,45.45 81.52,45.45 81.53,45.44 v81.59,45.44 77.3,45.44 75.72,47.02 75.72,61.14 74.7,62.16 v73.72,62.16 73.71,62.16 | v140.1,28.76 139.74,29.12 v139.74,34.15 139.74,36.17 140.56,36.99 145.19,36.99 146.43,38.23 v146.43,48.63 | v107.3,63.98 107.3,66.57 106.46,67.41 v98.78,67.41
  Bottom 0.254: K3.COM 46.43,21.4 47.25,22.22 47.25,25.25 46.69,25.81 43.47,25.81 v43.31,25.97 42.83,26.46 Q6.2
GND-BATT
  Top 0.203: X1.2 X2.1
  Top 0.406: X2.1 18.31,29.29 21.22,32.2 41.6,32.2 K3.NO
IO0  (via drill 0.35)
  Top 0.203: S2.1 94.31,94.3 R5.1 94.08,94.6 v94.08,95.89 | v102.33,78.52 102.33,76.88 103.52,75.69 104.76,75.69 | 104.76,75.69 v104.77,75.7 | U2.25 97.39,48.58 99.95,46.02 v99.95,45.69 | v99.95,71.14 103.99,71.14 104.76,71.91 104.76,75.69
  Bottom 0.203: 106.15,75.64 C11.1 | v94.08,95.89 94.08,79.65 95.83,77.9 101.71,77.9 v102.33,78.52 | v104.77,75.7 106.09,75.7 106.15,75.64 | v99.95,71.14 99.95,71.07 97.05,71.07 95.4,69.41 95.4,58.2 96.28,57.31 100.15,57.31 103.34,60.5 120.91,60.5 122.75,58.66 122.75,45.22 120.92,43.39 101.49,43.39 99.95,44.92 v99.95,45.69 | Q2.3 106.15,75.64
IO01  (via drill 0.35)
  Top 0.203: R28.1 59.98,97.37 58.17,95.57 S4.1 58.1,94.26 v55.84,94.26 | U9.25 56.47,46.84 54.25,44.62 v54.25,43.77
  Bottom 0.203: C18.1 29.3,66.14 Q9.3 34.79,62.83 | 34.79,62.83 34.79,91.91 33.56,93.14 28.8,93.14 28.1,93.84 28.1,96.73 28.75,97.38 40.33,97.38 43.74,93.98 49.06,93.98 49.83,94.75 55.35,94.75 v55.84,94.26 | v54.25,43.77 53.57,43.77 50.76,46.58 50.76,59.92 49.72,60.97 35.44,60.97 34.79,61.62 34.79,62.83
M1  (via drill 0.35)
  Top 0.203: U9.29 v59.01,53.64 v59.02,53.65 | v101.07,54.3 101.61,53.76 105.8,53.76 107.1,55.05 EBYTEE220-900T22D1.M1
  Bottom 0.203: v59.02,53.65 61.63,53.65 62.52,54.54 62.52,63.06 65.54,66.08 89.59,66.08 92.38,63.29 92.38,56.29 94.37,54.3 v101.07,54.3
M2_BATT-BACK-SWITCH  (via drill 0.35)
  Top 0.203: U9.24 53.68,49.57 52.83,50.42 v45.41,50.42 | v25.73,30.17 25.73,24.02 20.91,19.2 20.91,7.23 v20.96,7.23 | v22.11,1.39 119.86,1.39 120.65,0.6 128.16,0.6 130.16,2.6 130.16,15.06 131.43,16.34 142.22,16.34 v143.72,17.84 | v145.27,65.43 R36.2
  Bottom 0.203: v45.41,50.42 38.01,50.42 35.63,48.04 27.67,48.04 25.73,46.09 v25.73,30.17 | v20.96,7.23 20.96,2.37 22.11,1.23 v22.11,1.39 | v143.72,17.84 143.72,33.24 147.46,36.97 147.46,64.78 146.81,65.43 v145.27,65.43
M2_RX  (via drill 0.35)
  Top 0.203: R30.2 | R30.2 68.23,49.66 D14.A | v68.87,48.83 R30.2
  Bottom 0.203: K4.P2 74.8,31.27 75.55,32.03 75.55,42.21 68.95,48.81 68.89,48.81 v68.87,48.83 | v68.87,48.83
M2_SWITCHGPS  (via drill 0.35)
  Top 0.203: R22.2 84.2,30.24 v83.27,29.31 | v31.69,11.04 26.52,11.04 v25.52,12.05 | v4.62,52.54 31.82,52.54 v32.24,52.12 | v35.99,52.35 39.45,52.35 U9.11
  Bottom 0.203: v83.27,29.31 82.71,28.75 80.2,28.75 79.56,28.11 79.56,17.41 73.39,11.25 70,11.25 68.79,10.04 39.35,10.04 37.89,11.49 32.14,11.49 v31.69,11.04 | v25.52,12.05 20.47,12.05 3.33,29.19 3.33,51.25 v4.62,52.54 | v32.24,52.12 35.76,52.12 v35.99,52.35
M2_TX  (via drill 0.35)
  Top 0.203: v58.74,51.1 U9.27
  Bottom 0.203: K4.P1 73.89,42.79 70.04,46.65 60.31,46.65 58.74,48.22 v58.74,51.1
N$1
  Top 0.203: C4.2 62.88,87.96 63.14,88.21 67.39,88.21 Q3.2 68.79,88.2 70.95,88.2 72.2,86.95 72.2,82.75 73.45,81.5 U1.7
N$2
  Top 0.203: C5.2 62.89,81.19 64.82,79.26 Q3.1 68.12,79.23 72.86,79.23 73.86,80.23 U1.8
N$3
  Bottom 0.203: R1.2 114.48,79.82 113.77,80.53 Q1.1
N$4
  Bottom 0.203: Q8.1 21.29,56.53 20.65,57.18 20.65,59.19 R25.2
N$5  (via drill 0.35)
  Top 0.203: C3.1 88.48,83.98 v88.48,85.01 | v75.54,85.36 76.97,85.36 U1.4
  Bottom 0.203: v88.48,85.01 88.02,85.01 86.14,86.88 77.06,86.88 v75.54,85.36
N$6
  Top 0.203: R3.1 97.07,94.17 D3.A
N$7
  Top 0.203: SUPER-STEPDOWN1.+5V 5.84,77.25 D1.A
N$8
  Bottom 0.203: R2.2 111.73,74.55 110.48,73.31 Q2.1
N$9
  Top 0.203: R11.1 88.45,16.96 U4.1
N$10
  Top 0.203: R12.2 88.32,27.93 U4.4
N$11  (via drill 0.35)
  Top 0.203: U5.1 52.88,36.21 54.75,38.08 60.12,38.08 61,38.97 61,42.98 61.94,43.91 71.07,43.91 73.71,46.55 v78.19,46.55 | v115.79,59.34 115.33,59.34 109.07,65.6 104.57,65.6 R13.1
  Bottom 0.203: v78.19,46.55 95.17,46.55 97.55,48.93 100.78,48.93 101.88,47.83 101.88,45.01 102.86,44.02 118.09,44.02 119.44,45.37 119.44,52.59 118.47,53.56 118.47,58.18 117.3,59.34 v115.8,59.34 v115.79,59.34
N$12  (via drill 0.35)
  Top 0.203: D4.A 83.9,18.75 K1.16 | v97.33,20.51 97.3,20.54 Q4.3
  Bottom 0.203: K1.16 95.9,18.75 97.33,20.18 v97.33,20.51
N$13
  Top 0.203: Q4.1 95.1,25.99 94.42,26.66 92.2,26.66 U4.3
N$14
  Top 0.203: U5.4 60.43,36.21 R14.2
N$15
  Bottom 0.203: D5.A 55.58,24.87 Q5.3 60.97,24.87 61.69,25.59 61.69,29.25 61.04,29.9 59.55,29.9 K2.16
N$16
  Bottom 0.203: R26.2 24.17,61.88 Q9.1
N$17  (via drill 0.35)
  Top 0.203: v54.56,33.68 U5.3
  Bottom 0.203: Q5.1 56.83,27.07 54.58,29.32 54.58,33.67 v54.56,33.68
N$18
  Top 0.203: D9.A 71.94,71.47 R17.1
N$19
  Top 0.203: U6.4 46.39,16.61 R24.2
N$20
  Bottom 0.203: K3.A2 40.51,23.4 39.29,24.62 D6.A 40.61,30.09 Q6.3
N$21
  Top 0.203: D10.A 74.51,71.34 R18.1
N$22
  Top 0.203: R19.1 59.01,74.55 D11.A
N$23
  Top 0.203: R20.1 61.6,74.54 D12.A
N$24  (via drill 0.35)
  Top 0.203: U6.3 41.37,14.07 40.79,14.65 v40.79,15.67
  Bottom 0.203: v40.79,15.67 40.79,17.11 42.44,18.76 47.27,18.76 47.85,19.33 47.85,27.14 47.1,27.89 Q6.1
N$25
  Top 0.203: R23.1 32.34,16.61 U6.1
N$26  (via drill 0.35)
  Top 0.203: C16.1 53.63,76.5 50.53,73.39 28.09,73.39 26.58,74.91 26.58,91.67 28.04,93.13 41.5,93.13 v43.83,90.8 | v44.21,85.37 v44.22,85.37 U7.4
  Bottom 0.203: v43.83,90.8 43.83,85.75 v44.21,85.37
N$27
  Top 0.203: C13.2 31.1,79.5 31.67,78.94 36.11,78.94 | 36.11,78.94 Q7.1 | U7.8 41.6,80.29 40.24,78.93 36.12,78.93 36.11,78.94
N$28
  Top 0.203: C12.2 31.12,87.6 32.11,88.59 Q7.2 39.35,88.6 40.34,87.61 40.34,83.02 41.8,81.56 U7.7
N$29
  Top 0.203: R36.1 141.48,68.53 U13.1
N$30
  Top 0.203: R22.1 88.31,30.24 U11.1
N$31
  Top 0.203: Q10.1 95.08,39.41 94.43,40.05 U11.3
N$32
  Top 0.203: R29.2 89.22,40.45 U11.4
N$33  (via drill 0.35)
  Top 0.203: K4.16 83.44,33.2 D13.A 85.78,33.47 91.04,33.47 v91.33,33.76 | v97.28,32.88 97.28,32.89 Q10.3
  Bottom 0.203: v91.33,33.76 96.4,33.76 v97.28,32.88
N$34
  Top 0.203: U9.28 61.76,52.37 62.19,51.94 63.42,51.94 63.49,52 D14.C
N$35
  Top 0.203: D15.C 101.45,50.47 99.48,52.44 97.1,52.44 96.97,52.31 96.44,52.31 U2.28
N$36  (via drill 0.35)
  Top 0.152: R32.2 144.25,40.43 C22.1
  Top 0.203: R32.2 v142.35,42.23 | v140.26,48.61 142.02,48.61 C23.1
  Bottom 0.203: v142.35,42.23 142.35,47.75 141.47,48.63 140.27,48.63 v140.26,48.61
N$37  (via drill 0.35)
  Top 0.203: U12.9 135.33,28.26 v134.25,29.33 | R32.1 140.52,38.53 139.84,39.22 133.53,39.22 133.14,38.83 133.14,34.18 v132.82,33.85
  Bottom 0.203: v134.25,29.33 134.25,32.42 v132.82,33.85
N$38
  Top 0.2: D16.C 144.27,23.42 143.13,24.57 143.13,25.83 Q12.3
N$39
  Top 0.203: D16.A 142.06,20.81 R33.1
N$40
  Top 0.203: U13.4 142.09,81.63 R37.2
N$41
  Top 0.203: D17.C 135.41,52.45 135.97,53.01 135.97,54 136.46,54.49 R34.2
N$42
  Top 0.203: K5.16 128.65,73.11 129.26,73.72 137.95,73.72 138.94,74.71 138.94,85.66 139.68,86.4 Q11.3
  Top 0.406: K5.16 128.65,67.05 129.57,66.13 130.31,66.13 D18.A
N$43
  Top 0.203: Q11.1 146.02,85.45 147.3,84.18 147.3,78.86 146.09,77.64 U13.3
N$44
  Top 0.406: K5.S1 134.29,88.7 133.19,89.8 X7.2
OUT1
  Top 0.203: SV1.1 58.1,44.07 59.37,45.34 70.18,45.34 72.33,47.49 72.33,54.41 71.53,55.2 61.59,55.2 60.39,56.4 60.39,63 59.57,63.82 56.49,63.82 U9.37
OUT2
  Top 0.203: SV1.2 55.56,44.47 59.18,48.09 59.18,49.58 58.93,49.83 U9.26
OUT3
  Top 0.203: SV1.3 53.02,44.44 52.41,45.05 U9.23
OUT4
  Top 0.203: SV1.4 50.48,44.5 49.29,45.69 44.24,45.69 43.52,46.41 U9.16
OUT5
  Top 0.203: SV1.5 47.94,43.93 47.39,44.48 37.67,44.48 36.89,45.27 36.89,48.1 37.34,48.56 U9.14
OUT6
  Top 0.203: SV1.6 45.4,43.49 44.95,43.94 37.06,43.94 36.14,44.87 36.14,49.16 36.83,49.85 39.44,49.85 U9.13
OUT7
  Top 0.203: SV1.7 42.86,42.71 42.15,43.42 36.42,43.42 35.39,44.45 35.39,50.7 35.8,51.11 39.45,51.11 U9.12
OUT8
  Top 0.203: SV1.8 40.32,42.3 39.79,42.84 35.7,42.84 34.74,43.79 34.74,54.09 35.58,54.93 39.45,54.93 U9.9
OUT9
  Top 0.203: SV1.9 35.59,40.92 34.03,42.47 34.03,55.24 35,56.21 39.43,56.21 U9.8
OUT+  (via drill 0.35)
  Top 0.203: 94.67,81.17 D2.C 93.25,81.16 v93.25,79 | 94.67,81.17 96.05,81.17 D8.C | D4.C 84.93,25.18 R12.1 83.09,27.93 K1.1 | D13.C 85.23,37.47 | 85.23,37.47 82.93,37.47 K4.1 79.51,38.89 78.65,38.03 78.65,34.86 | 85.23,37.47 85.23,40.26 R29.1 85.03,41.4 86.76,43.12 119.24,43.12 120.01,43.88 136.8,43.88 v137.98,42.7 | D1.C 5.89,81.58 7.23,82.93 v8.91,82.93 C6.+ | K2.1 51.86,29.91 48.83,29.91 48.3,29.38 48.3,15.18 47.65,14.53 R24.1 46.58,12.14 46.11,11.67 41.13,11.67 39.87,10.42 39.87,5.24 41.02,4.1 61.77,4.1 62.6,4.93 62.6,8.82 64.53,10.75 72.23,10.75 | 113.86,16.64 ADS1.VDD 121.01,16.64 121.79,15.87 121.79,11.55 122.26,11.08 125.29,11.08 125.91,10.46 125.91,7.51 125.35,6.95 123.1,6.95 122.15,6 122.15,4.18 122.58,3.74 125.89,3.74 127.7,5.55 127.7,11.67 125.68,13.69 125.68,16.47 126.56,17.35 138.27,17.35 139.11,18.19 139.11,19.28 NEO-6MGPS1.5V | 113.86,16.64 102.17,16.64 ADS2.VDD | 113.86,16.64 113.15,17.36 113.15,31.18 111.89,32.44 108.65,32.44 107.86,31.65 107.86,29.57 U10.8 | v69.31,72.5 69.08,72.28 69.08,65.55 U3.3 69.14,63.35 66.06,60.27 U8.3 v66.05,57.1 | v55.71,80.22 D7.C | 78.65,26.29 78.65,34.86 | R14.1 61.11,33.64 77.42,33.64 78.65,34.86 | R37.1 144.12,82.98 143.59,83.51 140.46,83.51 139.84,82.88 139.84,71.62 139.07,70.86 136.33,70.86 K5.1 | EBYTEE220-900T22D1.VCC 117.26,61.6 119.03,63.37 134.06,63.37 134.71,64.02 134.71,66.15 | 94.67,81.17 94.67,86.54 99.66,91.53 R3.2 102.35,92.27 103.2,93.13 v108.31,93.13
  Top 0.254: X6.1 72.23,10.75 77.12,15.64 77.12,24.76 78.65,26.29 78.73,26.37 K1.1
  Top 0.406: K5.1 136.27,66.76 135.59,66.08 134.79,66.08 134.71,66.15 D18.C
  Bottom 0.203: C21.1 | C21.1 C19.1 C8.1 21.31,42.25 C7.1 | 34.85,28.78 D6.C 35.02,24.07 34.35,23.4 K3.A1 | 34.85,28.78 22.94,28.78 21.27,30.45 21.27,35.49 | 21.27,35.49 C21.1 | D5.C 50.08,28.97 50.97,29.87 K2.1 48.34,29.87 45.7,32.52 36.25,32.52 34.85,31.12 34.85,28.78 | 21.27,35.49 9.93,35.49 8.41,37 8.41,82.48 8.91,82.97 v8.91,82.93 | v93.25,79 92.54,78.29 87.89,78.29 87.29,78.9 87.29,85.01 86.05,86.24 78.01,86.24 74.97,83.21 56.62,83.21 55.71,82.29 v55.71,80.22 v55.71,80.23 56,79.93 60.37,79.93 63.01,77.29 63.01,73.47 63.98,72.5 v69.31,72.5 | NEO-6MGPS1.5V 139.09,27.18 138.46,27.81 138.46,42.22 v137.98,42.7 | K4.1 77.63,38.89 76.58,39.94 76.58,42.5 68.91,50.17 67.28,50.17 66.05,51.4 v66.05,57.1 | K5.1 133.55,70.92 132.52,71.95 132.52,88.98 128.37,93.13 v108.31,93.13
OUT-BATT
  Top 0.203: K5.P1 136.27,75.49 135.44,74.65 118.37,74.65 116.52,72.8 108.44,72.8 107.45,73.79 107.45,85.57 109.3,87.41 109.3,90.04 107.85,91.49 104.33,91.49 101.45,88.61 101.45,85.17 100.86,84.58 D8.A
PB-PWR
  Top 0.203: R9.2 123.75,9.53 118.42,4.21 106.11,4.21 104.75,5.56 X3.3
RF_IN  (via drill 0.35)
  Top 0.203: U12.11 137.53,29.89 136.73,30.68 132.44,30.68 131.57,29.81 v131.57,29.27 | v130.86,33.85 132.37,35.35 132.37,39.14 133.11,39.88 139.99,39.88 140.58,40.47 140.58,43.18 141.21,43.81 145.61,43.81 146.35,43.07 146.35,38.86 146.08,38.59 C22.2 144.81,37.26 144.41,36.86 143.28,36.86 143,36.57 J3.3
  Bottom 0.203: v131.57,29.27 131.57,33.14 v130.86,33.85
RTS  (via drill 0.35)
  Top 0.203: v85.83,84.42 85.83,85.89 85.13,86.59 82.54,86.59 U1.14
  Bottom 0.203: R2.1 111.18,78.63 Q1.2 108.32,77.92 107.7,77.29 87.06,77.29 85.83,78.52 v85.83,84.42
RTS1  (via drill 0.35)
  Top 0.203: v25.5,58.43 25.5,60.78 26.28,61.56 26.28,64.35 25.17,65.46 20.59,65.46 17.34,68.7 v16.6,68.7 | v53.29,86.64 U7.14
  Bottom 0.203: Q8.2 v25.5,58.43 24.19,58.43 R26.1 | v16.6,68.7 16.6,96.46 18.24,98.09 40.85,98.09 44.09,94.85 49.08,94.85 49.55,95.31 62.65,95.31 65.26,92.7 73.2,92.7 76.17,89.74 82.89,89.74 83.4,90.25 87.85,90.25 89.61,88.48 89.61,87.03 89.15,86.57 87.8,86.57 86.31,88.06 75.92,88.06 72.56,91.42 54.52,91.42 53.8,90.7 53.8,87.16 v53.29,86.64
RX
  Top 0.203: U1.3 74.98,86.58 73.92,87.64 73.92,90.79 72.6,92.11 61.47,92.11 58.36,89 58.36,83.67 65.05,76.99 65.05,75.22 65.6,74.67 69.31,74.67 71.59,76.96 73.99,76.96 74.51,76.44 D10.C 89.33,75.46 91.18,73.61 91.18,62.14 92.04,61.28 U2.35
RX1  (via drill 0.35)
  Top 0.203: D12.C 61.57,77.15 v61.16,77.56 59.51,79.2 54.5,79.2 49.98,74.68 28.92,74.68 27.76,75.85 27.76,90.71 28.88,91.83 40.87,91.83 42.32,90.38 42.32,88.2 43.88,86.64 U7.3 | U9.35 54.31,61.26 v54.25,61.32
  Bottom 0.254: v61.16,77.56 59.48,79.24 57.57,79.24 56.49,78.15 56.49,62.6 55.21,61.32 v54.25,61.32
RX_GPS  (via drill 0.35)
  Top 0.203: U12.21 127.93,35.29 v127.59,34.95
  Bottom 0.203: 129.86,22.24 128.98,21.36 128.98,15.75 SJ2.2 | NEO-6MGPS1.RX 136.57,19.31 136.57,21.01 135.33,22.25 130.47,22.25 130.47,22.24 129.86,22.24 | v127.59,34.95 127.59,22.95 128.29,22.24 129.86,22.24
RX_GPS1
  Bottom 0.203: K4.O2 67.88,31.27 67.34,30.73 67.34,16.6 68.01,15.93 70.42,15.93 71.4,16.91 71.4,20.64 73.16,22.4 75.56,22.4 76.84,21.12 76.84,16.93 72.99,13.08 66.48,13.08 64.62,14.94 44.94,14.94 42.25,12.26 28.83,12.26 27.86,11.29 27.86,3.2 29.41,1.65 119.69,1.65 121.79,3.75 138.78,3.75 139.7,4.67 139.86,4.83 140.77,5.74 140.77,13.02 139.3,14.49 135.09,14.49 134.2,13.6 134.2,12.64 133.44,11.88 129.26,11.88 128.88,12.26 SJ2.1
RX_LORA
  Top 0.203: K1.P1 73.91,23.63 72.71,22.42 67.57,22.42 66.58,23.41 66.58,30.2 65.44,31.34 63.8,31.34 K4.S2
  Bottom 0.203: K4.S2 62.38,31.27 60.47,33.19 60.47,42.27 59.23,43.51 56.09,43.51 51.55,48.05 51.55,56.5 52.8,57.75 60.35,57.75 61.25,58.65 61.25,63.89 64.83,67.48 90.74,67.48 94.15,64.07 94.15,57.81 95.65,56.32 100.92,56.32 104.21,59.6 108.67,59.6 109.64,58.63 EBYTEE220-900T22D1.RXD
RX_MICRO
  Top 0.203: U2.13 73.8,49.85 72.91,48.96 72.91,47.02 70.58,44.69 60.86,44.69 59.77,43.6 59.77,39.82 58.78,38.83 57.45,38.83 56.83,39.44 56.83,44.36 58.79,46.32 69.96,46.32 71.57,47.93 71.57,53.63 70.77,54.43 61.35,54.43 60.87,54.91 U9.30
RXLORA_CONFIG
  Top 0.254: X4.2 60.05,8.79 62.48,11.22 62.48,13.72 65.64,16.89 65.64,25.34 64.51,26.46 63.85,26.46 K1.S1
RXLORA_MICRO  (via drill 0.35)
  Top 0.203: v96.26,45.46 97.26,44.46 101.97,44.46 102.79,45.29 D15.A 105.05,46.2 R31.1
  Bottom 0.203: K1.O1 68.83,27.34 70.58,29.09 75.92,29.09 76.75,29.93 76.75,34.77 78.23,36.25 92.19,36.25 93.39,37.45 93.39,44.57 94.28,45.46 v96.26,45.46
SCL  (via drill 0.35)
  Top 0.203: ADS1.SCL 121.15,21.72 121.67,22.24 121.67,25.15 121.29,25.54 115.04,25.54 114.35,26.23 114.35,32.08 112.92,33.51 108.3,33.51 106.89,32.1 U10.10 | v98.1,62.54 96.37,62.54 U2.36
  Bottom 0.203: X6.3 82.39,11.18 83.36,12.14 113.14,12.14 116.94,15.94 116.94,21.03 117.66,21.75 119.85,21.75 ADS1.SCL 122.95,21.72 124.12,22.9 124.12,59.88 121.42,62.58 98.14,62.58 v98.1,62.54
SCL1  (via drill 0.35)
  Top 0.203: v117.41,40.74 118.23,41.56 135.07,41.56 135.91,42.39 v135.91,42.71 | v96.69,79.07 96.69,75.01 96.14,74.46 v96.14,74.42 | v59.07,61.99 58.54,62.53 U9.36
  Bottom 0.203: X8.1 30.51,4.1 32.37,2.24 73.75,2.24 75.37,3.86 75.37,9.41 79.88,13.92 96.41,13.92 99.68,17.19 99.68,20.52 100.86,21.7 ADS2.SCL 114.19,21.7 117.52,25.02 117.52,28.13 116.27,29.38 116.27,39.6 v117.41,40.74 | v135.91,42.71 136.16,42.96 136.16,52.4 119.59,68.97 119.59,79.56 112.44,86.71 98.04,86.71 96.64,85.31 96.64,79.12 v96.69,79.07 | v96.14,74.42 95.74,74.02 81.87,74.02 77.1,69.25 64.05,69.25 59.95,65.15 59.95,62.87 v59.07,61.99
SDA  (via drill 0.35)
  Top 0.203: ADS1.SDA 114.37,24.26 113.73,24.9 113.73,31.53 112.3,32.97 108.36,32.97 107.37,31.98 107.37,29.57 U10.9 | v99.16,58.71 96.39,58.71 U2.33
  Bottom 0.203: X6.2 77.31,9.79 80.71,13.18 112.9,13.18 115.75,16.04 115.75,21.58 118.49,24.32 119.82,24.32 ADS1.SDA 122.3,24.26 123.49,25.45 123.49,59.22 121.3,61.42 101.89,61.42 99.18,58.71 v99.16,58.71
SDA1  (via drill 0.35)
  Top 0.203: v115.31,40.74 115.31,41.62 115.98,42.29 119.36,42.29 120.38,43.31 133.27,43.31 v133.87,42.71 | v98.65,79.17 98.65,74.63 v97.97,73.95 | v59.2,58.66 59.14,58.72 U9.33
  Bottom 0.203: X8.2 35.59,4.41 37.16,2.84 72.83,2.84 74.34,4.35 74.34,9.65 79.39,14.71 95.87,14.71 99.04,17.88 99.04,22.09 101.19,24.24 ADS2.SDA 115.33,24.24 116.5,25.41 116.5,27.62 115.31,28.81 v115.31,40.74 | v133.87,42.71 135.15,43.99 135.15,52.02 118.23,68.94 118.23,79.62 112.26,85.58 99.52,85.58 98.65,84.71 v98.65,79.17 | v97.97,73.95 97.26,73.24 82.37,73.24 77.45,68.32 64.42,68.32 60.59,64.5 60.59,59.8 59.45,58.66 v59.2,58.66
TIMEPULSE
  Top 0.2: 142.98,30.23 143.74,30.23 144.12,29.85 Q12.1
  Top 0.203: U12.3 126.83,30.05 128.06,31.29 137.28,31.29 138.35,30.23 142.98,30.23
TX  (via drill 0.35)
  Top 0.203: D9.C 71.26,75.22 v70.15,74.1 65.24,74.1 64.48,74.86 64.48,76.72 57.87,83.34 57.87,89.23 61.33,92.69 72.86,92.69 74.49,91.07 74.49,88.45 75.09,87.85 U1.2 | v76.59,74.32 89.54,74.32 90.55,73.32 90.55,61.66 92.2,60.01 U2.34
  Bottom 0.203: v70.15,74.1 70.39,74.34 76.59,74.34 v76.59,74.32
TX1  (via drill 0.35)
  Top 0.203: D11.C 59.02,77.79 v58.65,78.16 58.55,78.27 54.5,78.27 50.29,74.05 28.38,74.05 27.18,75.25 27.18,91.29 28.39,92.49 41.13,92.49 42.99,90.63 42.99,88.91 43.99,87.91 U7.2
  Top 0.254: v59.14,59.94 59.1,59.99 U9.34
  Bottom 0.203: v59.14,59.94 57.86,59.94 57.13,60.67 57.13,64.05
  Bottom 0.254: v58.65,78.16 57.65,78.16 57.13,77.63 57.13,64.05
TX_GPS  (via drill 0.35)
  Top 0.203: U12.20 129.03,35.32 129.47,34.87 v129.49,34.87
  Bottom 0.203: NEO-6MGPS1.TX 134.01,16.43 134.04,16.4 | 134.04,16.4 134.47,15.97 137.11,15.97 137.84,16.69 137.84,21.65 136.6,22.89 130.22,22.89 129.49,23.62 v129.49,34.87 | SJ3.2 132.01,15.98 133.61,15.98 134.04,16.4
TX_GPS1
  Bottom 0.203: K4.O1 67.39,38.89 66.8,38.31 66.8,16 67.5,15.3 71.21,15.3 72.36,16.44 72.36,20.49 73.47,21.6 74.96,21.6 75.87,20.69 75.87,17.08 72.61,13.83 66.82,13.83 64.86,15.79 44.74,15.79 41.93,12.98 28.29,12.98 27.18,11.87 27.18,1.6 27.79,0.99 138.7,0.99 141.87,4.16 141.87,13.2 139.74,15.33 134.5,15.33 133.24,14.07 SJ3.1
TX_LORA
  Bottom 0.203: K1.P2 73.91,16.48 71.96,14.54 67.14,14.54 66.24,15.43 66.24,36.31 63.73,38.81 K4.S1 62.14,38.89 61.16,39.87 61.16,42.59 59.65,44.1 57.04,44.1 52.22,48.93 52.22,55.88 53.49,57.16 61.03,57.16 61.94,58.07 61.94,63.49 65.3,66.86 90.18,66.86 93.37,63.67 93.37,57.52 95.33,55.56 101.8,55.56 103.41,53.95 110.81,53.95 112.18,55.32 EBYTEE220-900T22D1.TXD
TX_MICRO  (via drill 0.35)
  Top 0.203: U2.23 92.3,44.97 91.4,44.06 74.54,44.06 71.83,41.35 71.83,36.94 71.05,36.17 66.96,36.17 66.02,37.11 v66.02,40.26 | v58.3,56.17 U9.31
  Bottom 0.203: v66.02,40.26 61.53,44.75 57.39,44.75 53.02,49.11 53.02,55.1 54.09,56.17 v58.3,56.17
TXLORA_CONFIG
  Top 0.254: X4.1 54.97,13.04 56.41,14.48 61.98,14.48 63.78,16.29 63.78,18.72 K1.S2
TXLORA_MICRO  (via drill 0.35)
  Top 0.203: v100.19,47.72 100.19,50.51 99.57,51.13 U2.27
  Bottom 0.203: K1.O2 68.83,22.07 70.15,23.39 77.12,23.39 78.52,24.79 78.52,34.14 79.54,35.16 92.92,35.16 94.56,36.79 94.56,43.3 95.41,44.15 96.77,44.15 97.29,44.67 97.29,47.43 97.86,48.01 99.9,48.01 v100.19,47.72
USB1_N
  Top 0.203: J2.2 49.1,84.86 47.08,82.83 U7.6
USB1_P
  Top 0.203: J2.3 48.45,84.71 47.85,84.1 U7.5
USB_N
  Top 0.203: J1.2 80.48,85.06 78.19,82.77 U1.6
USB_P
  Top 0.203: J1.3 79.83,84.91 78.95,84.03 78.95,84.04 U1.5
VALVE
  Top 0.203: U2.37 100.75,63.82 R13.2
VALVE1
  Top 0.406: X5.2 50.45,7.02 51.9,8.46 K2.S1
VALVE2
  Top 0.406: X5.1 42.74,7.5 45.7,10.47 48.02,10.47 49.41,11.86 49.41,21.76 49.94,22.29 51.86,22.29 K2.P1
VCC  (via drill 0.35)
  Top 0.203: R17.2 71.88,69.44 | 71.88,69.44 74.47,69.44 R18.2 | U3.2 U3.4 71.4,58.76 v68.68,58.76 | U3.2 71.41,65.51 71.41,68.98 71.88,69.44 | U3.2 71.43,66.42 72.26,67.25 80.84,67.25 82.17,65.92 82.17,64.62 81.35,63.81 79.37,63.81 U2.2 v77.77,63.82 | R4.2 67.98,95.15 v68.03,95.1 | R5.2 94.33,92.42 v91.94,92.42 | v106.23,50.65 106.27,50.61 R31.2 106.28,49.34 R6.2 109.44,49.35 R7.2 R8.2 114.74,49.38 115.6,49.38 115.64,49.34 R10.2 118.9,49.34 121.57,46.66 136.26,46.66 v137.54,47.94 | v15.35,51.32 30.79,51.32 v32.18,49.93 | v48.43,52.05 49.55,53.17 53.46,53.17 54.22,52.41 v54.22,51.52
  Bottom 0.203: v68.03,95.1 69.21,93.92 73.75,93.92 76.84,90.83 82.23,90.83 82.73,91.33 90.85,91.33 v91.94,92.42 91.94,95.82 93.32,97.2 102.72,97.2 105.05,94.86 105.05,88.43 105.92,87.56 113.16,87.56 121.01,79.71 121.01,69.05 136.95,53.1 136.95,48.53 v137.54,47.94 | v106.23,50.65 106.21,50.63 83.97,50.63 83.19,49.85 80.57,49.85 79.7,50.73 79.7,63.34 79.22,63.82 v77.77,63.82 | C9.1 11.84,39.15 10.23,40.76 10.23,49.62 11.93,51.32 v15.35,51.32 | v32.18,49.93 35.71,49.93 37.83,52.05 v48.43,52.05 | v54.22,51.52 54.94,52.24 59.58,52.24 60.35,51.47 60.35,48.38 61.32,47.41 64.15,47.41 64.92,48.17 64.92,58.04 65.66,58.78 68.66,58.78 v68.68,58.76
VCC1  (via drill 0.35, 0.4)
  Top 0.2: 140.1,22.02 140.77,22.68 R33.2 | D17.A 134.09,56.38 132.43,56.38
  Top 0.203: R20.2 61.59,70.36 R19.2 45.08,70.36 43.16,68.45 43.16,64.93 42.02,63.79 U9.2 34.08,63.8 32.89,64.98 v32.86,64.98 | R20.2 61.6,67.64 U8.4 U8.2 63.79,58.76 v63.79,56.96 | R28.2 v62.03,94.06 57.42,89.46 57.42,82.97 63.85,76.55 63.85,70.59 v63.63,70.37 R20.2 | R27.2 33.68,96.1 v34.13,96.55 | R30.1 63.42,48.82 63.4,48.8 v63.32,48.8 | 140.1,22.02 139.38,21.29 v126.96,21.29 123.55,21.29 122.84,22 122.84,29.98 123.59,30.72 124.84,30.72 v125.38,30.19 | v125.7,34.99 125.7,36.98 U12.23 | R35.2 114.92,8.09 115.45,7.56 119.26,7.56 v121.15,9.44 | 132.43,56.38 v126.16,56.38
  Bottom 0.203: C20.1 13.6,46.48 14.33,47.21 17.23,47.21 18.08,48.06 18.08,66.17 21.33,69.41 30.38,69.41 32.69,67.11 32.69,65.15 v32.86,64.98 | v34.13,96.55 40.06,96.55 43.32,93.29 49.38,93.29 50.21,94.12 51.23,94.12 52.7,92.65 60.6,92.65 62,94.06 v62.03,94.06 | v63.32,48.8 63.32,56.49 v63.79,56.96 | v125.38,30.19 125.38,34.66 v125.7,34.99 125.13,35.56 125.13,56.38 | v63.63,70.37 77.02,70.37 81.39,74.75 94.08,74.75 95.28,75.95 101.13,75.95 101.89,75.18 101.89,70.8 103.26,69.43 116.02,69.43 125.13,60.32 125.13,56.38 | v121.15,9.44 121.15,13.56 127.02,19.42 127.02,21.33 127,21.33 v126.96,21.29 | v126.16,56.38 125.13,56.38
VUSB  (via drill 0.35)
  Top 0.203: C1.1 90.89,85.3 | 90.89,85.3 91.18,85.59 92.88,85.59 93.26,85.2 D2.A | J1.1 81.13,90.51 U1.16 v83.8,89.12 | 90.89,85.3 v88.51,87.68 | C2.+ 24.39,90.76 27.96,94.33 v29.67,94.33
  Bottom 0.203: v29.67,94.33 35.68,94.33 36.65,95.3 39.34,95.3 42.59,92.05 72.97,92.05 75.89,89.12 v83.8,89.12 87.07,89.12 v88.51,87.68
VUSB1  (via drill 0.35)
  Top 0.203: 49.75,92.8 49.75,90.65 U7.16 55.22,89.18 55.71,88.7 D7.A | 49.75,92.8 J2.1 | v15.64,66.05 4.76,66.05 3.44,67.37 3.44,84.38 6.15,87.1 16.84,87.1 18.38,85.56 C15.+ 18.38,93.63 20.61,95.87 v29.95,95.87 | v50.85,93.11 50.06,93.11 49.75,92.8
  Bottom 0.203: C14.1 12.77,41.79 12.09,42.47 12.09,46.37 14.01,48.29 16.75,48.29 17.43,48.98 17.43,64.25 v15.64,66.05 | v29.95,95.87 30.8,95.01 35.24,95.01 36.1,95.88 39.8,95.88 43.03,92.65 50.4,92.65 v50.85,93.11

## Text on the board
tPlace: BATT-BACKUP | GND | 24V | GND | PB-PWR | SCL2 | SDA2 | VALVE | GND | CYBLE1 | CYBLE2 | PWR-Ind | CYBLE5 | TX | RX | GND - LORA | 5V+ | SDA | SCL | BATT